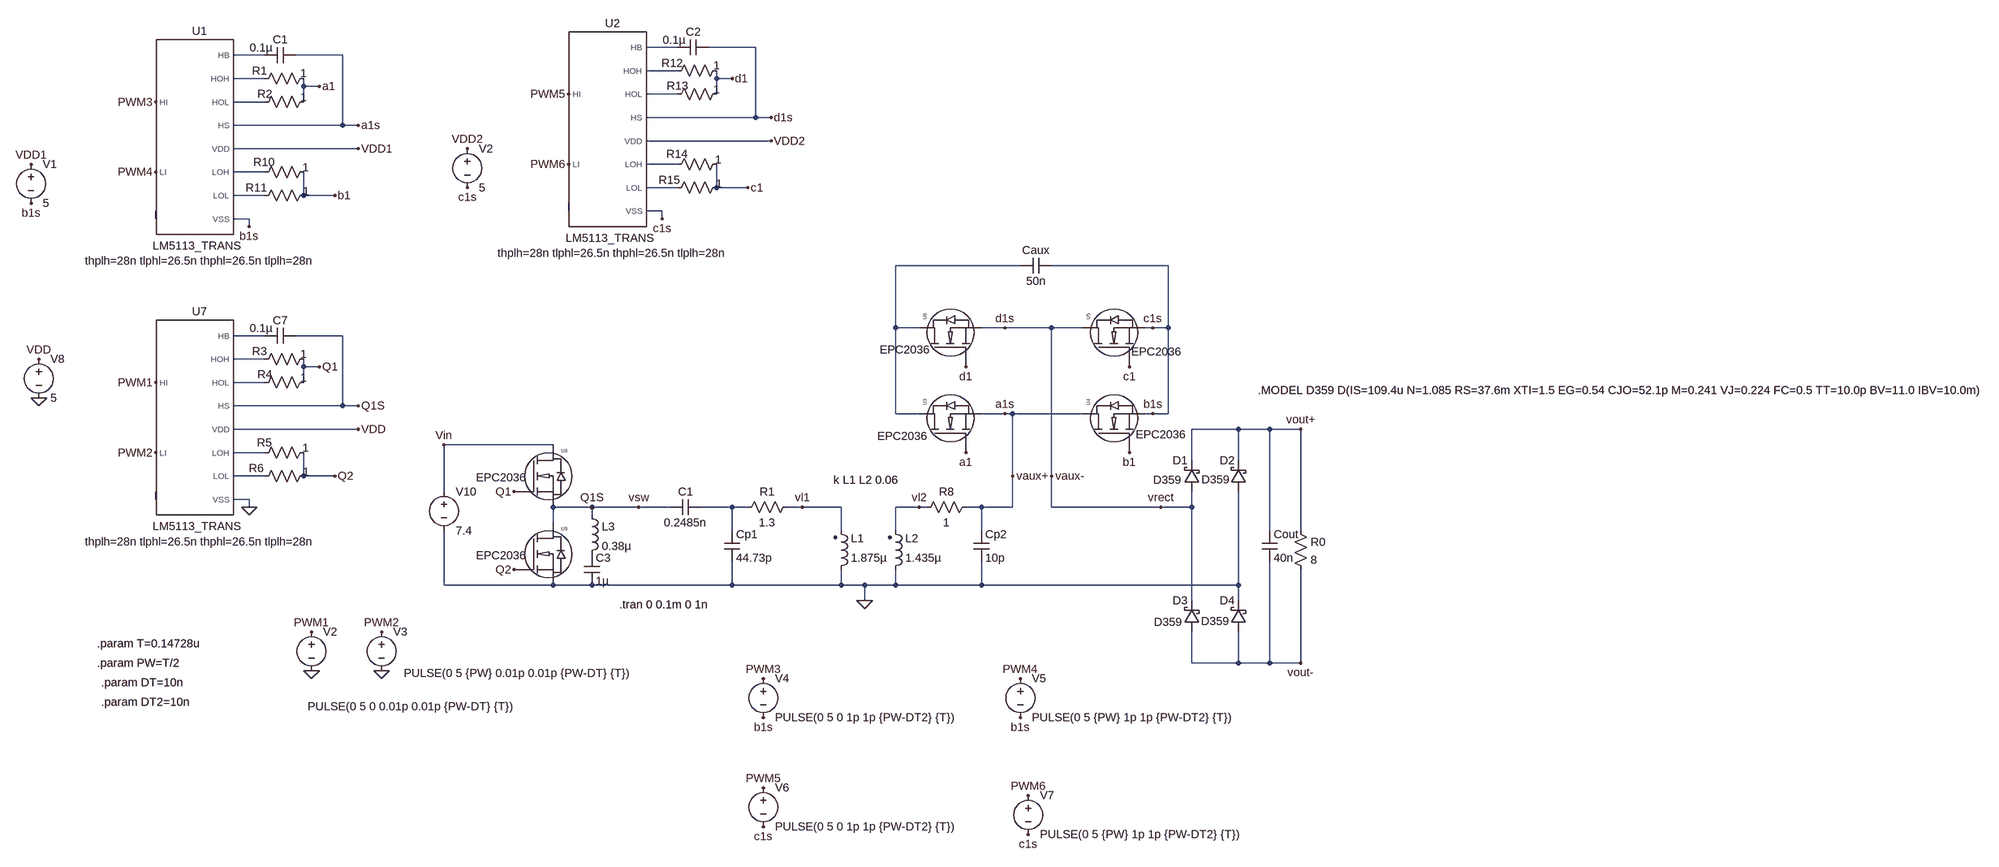
[diagram p0: schematic WPT_Coupled_full_driver.asc]
WPT_Coupled_full_driver.asc, the LTspice schematic file:
Version 4
SHEET 1 3496 796
WIRE 704 -1104 640 -1104
WIRE 864 -1104 768 -1104
WIRE -144 -1088 -208 -1088
WIRE 16 -1088 -80 -1088
WIRE 704 -1056 640 -1056
WIRE -144 -1040 -208 -1040
WIRE 784 -1040 784 -1056
WIRE 816 -1040 784 -1040
WIRE -64 -1024 -64 -1040
WIRE -32 -1024 -64 -1024
WIRE 704 -1008 640 -1008
WIRE 784 -1008 784 -1040
WIRE -144 -992 -208 -992
WIRE -64 -992 -64 -1024
WIRE 864 -960 864 -1104
WIRE 864 -960 640 -960
WIRE 896 -960 864 -960
WIRE 16 -944 16 -1088
WIRE 16 -944 -208 -944
WIRE 48 -944 16 -944
WIRE 896 -912 640 -912
WIRE 48 -896 -208 -896
WIRE 704 -864 640 -864
WIRE -144 -848 -208 -848
WIRE 704 -816 640 -816
WIRE 784 -816 784 -864
WIRE 848 -816 784 -816
WIRE -144 -800 -208 -800
WIRE -64 -800 -64 -848
WIRE 0 -800 -64 -800
WIRE 480 -768 480 -784
WIRE 672 -768 640 -768
WIRE -368 -752 -368 -768
WIRE -176 -752 -208 -752
WIRE 672 -752 672 -768
WIRE -176 -736 -176 -752
WIRE 1408 -656 1152 -656
WIRE 1712 -656 1472 -656
WIRE 1152 -528 1152 -656
WIRE 1200 -528 1152 -528
WIRE 1376 -528 1328 -528
WIRE 1472 -528 1376 -528
WIRE 1536 -528 1472 -528
WIRE 1680 -528 1664 -528
WIRE 1712 -528 1712 -656
WIRE 1712 -528 1680 -528
WIRE -144 -512 -208 -512
WIRE 16 -512 -80 -512
WIRE -144 -464 -208 -464
WIRE -64 -448 -64 -464
WIRE -32 -448 -64 -448
WIRE -144 -416 -208 -416
WIRE -64 -416 -64 -448
WIRE 16 -368 16 -512
WIRE 16 -368 -208 -368
WIRE 48 -368 16 -368
WIRE 1152 -352 1152 -528
WIRE 1200 -352 1152 -352
WIRE 1376 -352 1328 -352
WIRE 1392 -352 1376 -352
WIRE 1536 -352 1392 -352
WIRE 1680 -352 1664 -352
WIRE 1712 -352 1712 -528
WIRE 1712 -352 1680 -352
WIRE 48 -320 -208 -320
WIRE 1856 -320 1760 -320
WIRE 1920 -320 1856 -320
WIRE 1984 -320 1920 -320
WIRE 448 -288 224 -288
WIRE -144 -272 -208 -272
WIRE 1760 -256 1760 -320
WIRE 1856 -256 1856 -320
WIRE -144 -224 -208 -224
WIRE -64 -224 -64 -272
WIRE 0 -224 -64 -224
WIRE 1392 -224 1392 -352
WIRE 1472 -224 1472 -528
WIRE 224 -192 224 -288
WIRE -368 -176 -368 -192
WIRE -176 -176 -208 -176
WIRE -176 -160 -176 -176
WIRE 528 -160 448 -160
WIRE 624 -160 528 -160
WIRE 688 -160 624 -160
WIRE 816 -160 752 -160
WIRE 848 -160 816 -160
WIRE 960 -160 928 -160
WIRE 1040 -160 960 -160
WIRE 1200 -160 1152 -160
WIRE 1216 -160 1200 -160
WIRE 1328 -160 1296 -160
WIRE 1392 -160 1392 -224
WIRE 1392 -160 1328 -160
WIRE 1472 -160 1472 -224
WIRE 1696 -160 1472 -160
WIRE 1760 -160 1760 -192
WIRE 1760 -160 1696 -160
WIRE 528 -144 528 -160
WIRE 448 -128 448 -160
WIRE 816 -112 816 -160
WIRE 1040 -112 1040 -160
WIRE 1152 -112 1152 -160
WIRE 1328 -112 1328 -160
WIRE 1920 -112 1920 -320
WIRE 1984 -112 1984 -320
WIRE 224 0 224 -112
WIRE 448 0 224 0
WIRE 528 0 448 0
WIRE 816 0 816 -48
WIRE 816 0 528 0
WIRE 1040 0 1040 -32
WIRE 1040 0 816 0
WIRE 1088 0 1040 0
WIRE 1152 0 1152 -32
WIRE 1152 0 1088 0
WIRE 1328 0 1328 -48
WIRE 1328 0 1152 0
WIRE 1856 0 1856 -192
WIRE 1856 0 1328 0
WIRE 1088 32 1088 0
WIRE 1760 32 1760 -160
WIRE 1856 32 1856 0
WIRE 1760 160 1760 96
WIRE 1856 160 1856 96
WIRE 1856 160 1760 160
WIRE 1920 160 1920 -48
WIRE 1920 160 1856 160
WIRE 1984 160 1984 -32
WIRE 1984 160 1920 160
FLAG -608 -464 VDD
FLAG -608 -384 0
FLAG -32 -448 Q1
FLAG 0 -224 Q2
FLAG 48 -368 Q1S
FLAG -368 -416 PWM1
FLAG -368 -272 PWM2
FLAG 48 -320 VDD
FLAG -176 -160 0
FLAG 1088 32 0
FLAG 960 -160 vl1
FLAG 1200 -160 vl2
FLAG 368 -192 Q1
FLAG 368 -32 Q2
FLAG 96 176 0
FLAG 528 -160 Q1S
FLAG 1296 -272 a1
FLAG 1632 -448 c1
FLAG 1632 -272 b1
FLAG 1296 -448 d1
FLAG 880 192 PWM3
FLAG 1408 192 PWM4
FLAG 880 272 b1s
FLAG 1408 272 b1s
FLAG 880 416 PWM5
FLAG 1424 432 PWM6
FLAG 880 496 c1s
FLAG 1424 512 c1s
FLAG 1984 -320 vout+
FLAG 1984 160 vout-
FLAG 1392 -224 vaux+
FLAG 1472 -224 vaux-
FLAG 224 -288 Vin
FLAG -48 96 PWM1
FLAG 96 96 PWM2
FLAG 1376 -352 a1s
FLAG 1376 -528 d1s
FLAG 1680 -352 b1s
FLAG 1680 -528 c1s
FLAG 1696 -160 vrect
FLAG 624 -160 vsw
FLAG -48 176 0
FLAG -32 -1024 a1
FLAG 0 -800 b1
FLAG 48 -944 a1s
FLAG -368 -992 PWM3
FLAG -368 -848 PWM4
FLAG 48 -896 VDD1
FLAG -176 -736 b1s
FLAG 816 -1040 d1
FLAG 848 -816 c1
FLAG 896 -960 d1s
FLAG 480 -1008 PWM5
FLAG 480 -864 PWM6
FLAG 896 -912 VDD2
FLAG 672 -752 c1s
FLAG -624 -864 VDD1
FLAG -624 -784 b1s
FLAG 272 -896 VDD2
FLAG 272 -816 c1s
SYMBOL LM5113_TRANS -272 -240 R0
SYMATTR InstName U7
SYMBOL voltage -608 -480 R0
WINDOW 123 0 0 Left 0
WINDOW 39 0 0 Left 0
SYMATTR InstName V8
SYMATTR Value 5
SYMBOL res -48 -480 R90
WINDOW 0 16 107 VBottom 2
WINDOW 3 -10 16 VTop 2
SYMATTR InstName R3
SYMATTR Value 1
SYMBOL res -48 -432 R90
WINDOW 0 15 96 VBottom 2
WINDOW 3 -9 16 VTop 2
SYMATTR InstName R4
SYMATTR Value 1
SYMBOL res -48 -288 R90
WINDOW 0 11 97 VBottom 2
WINDOW 3 -9 12 VTop 2
SYMATTR InstName R5
SYMATTR Value 1
SYMBOL res -48 -240 R90
WINDOW 0 16 113 VBottom 2
WINDOW 3 -8 11 VTop 2
SYMATTR InstName R6
SYMATTR Value 1
SYMBOL cap -80 -528 R90
WINDOW 0 0 32 VBottom 2
WINDOW 3 -15 71 VTop 2
SYMATTR InstName C7
SYMATTR Value 0.1µ
SYMBOL cap 752 -176 R90
WINDOW 0 0 32 VBottom 2
WINDOW 3 32 32 VTop 2
SYMATTR InstName C1
SYMATTR Value 0.2485n
SYMBOL ind2 1024 -16 M180
WINDOW 0 36 80 Left 2
WINDOW 3 36 40 Left 2
SYMATTR InstName L1
SYMATTR Value 1.875µ
SYMATTR Type ind
SYMBOL ind2 1136 -16 M180
WINDOW 0 36 80 Left 2
WINDOW 3 36 40 Left 2
SYMATTR InstName L2
SYMATTR Value 1.435µ
SYMATTR Type ind
SYMBOL res 944 -176 R90
WINDOW 0 0 56 VBottom 2
WINDOW 3 32 56 VTop 2
SYMATTR InstName R1
SYMATTR Value 1.3
SYMBOL res 1312 -176 R90
WINDOW 0 0 56 VBottom 2
WINDOW 3 32 56 VTop 2
SYMATTR InstName R8
SYMATTR Value 1
SYMBOL res 1968 -128 R0
SYMATTR InstName R0
SYMATTR Value 8
SYMBOL voltage -48 80 R0
WINDOW 123 0 0 Left 0
WINDOW 39 0 0 Left 0
WINDOW 3 -8 169 Left 2
SYMATTR Value PULSE(0 5 0 0.01p 0.01p {PW-DT} {T})
SYMATTR InstName V2
SYMBOL EPCGaN 368 -192 R0
WINDOW 3 -78 -29 Left 2
SYMATTR Value EPC2036
SYMATTR InstName U8
SYMBOL EPCGaN 368 -32 R0
WINDOW 3 -78 -29 Left 2
SYMATTR Value EPC2036
SYMATTR InstName U9
SYMBOL voltage 224 -208 R0
WINDOW 123 0 0 Left 0
WINDOW 39 0 0 Left 0
SYMATTR InstName V10
SYMATTR Value 7.4
SYMBOL voltage 96 80 R0
WINDOW 123 0 0 Left 0
WINDOW 39 0 0 Left 0
WINDOW 3 46 101 Left 2
SYMATTR Value PULSE(0 5 {PW} 0.01p 0.01p {PW-DT} {T})
SYMATTR InstName V3
SYMBOL cap 512 -64 R0
SYMATTR InstName C3
SYMATTR Value 1µ
SYMBOL ind 512 -160 R0
SYMATTR InstName L3
SYMATTR Value 0.38µ
SYMBOL cap 1472 -672 R90
WINDOW 0 0 32 VBottom 2
WINDOW 3 32 32 VTop 2
SYMATTR InstName Caux
SYMATTR Value 50n
SYMBOL EPCGaN 1296 -272 R270
WINDOW 3 34 -182 VRight 2
SYMATTR Value EPC2036
SYMATTR InstName U3
SYMBOL EPCGaN 1632 -272 R270
WINDOW 3 37 13 VRight 2
SYMATTR Value EPC2036
SYMATTR InstName U4
SYMBOL EPCGaN 1632 -448 R270
WINDOW 3 31 4 VRight 2
SYMATTR Value EPC2036
SYMATTR InstName U5
SYMBOL EPCGaN 1296 -448 R270
WINDOW 3 35 -177 VRight 2
SYMATTR Value EPC2036
SYMATTR InstName U6
SYMBOL voltage 880 176 R0
WINDOW 123 0 0 Left 0
WINDOW 39 24 124 Left 2
SYMATTR InstName V4
SYMATTR Value PULSE(0 5 0 1p 1p {PW-DT2} {T})
SYMBOL voltage 1408 176 R0
WINDOW 123 0 0 Left 0
WINDOW 39 24 124 Left 2
SYMATTR InstName V5
SYMATTR Value PULSE(0 5 {PW} 1p 1p {PW-DT2} {T})
SYMBOL voltage 880 400 R0
WINDOW 123 0 0 Left 0
WINDOW 39 24 124 Left 2
SYMATTR InstName V6
SYMATTR Value PULSE(0 5 0 1p 1p {PW-DT2} {T})
SYMBOL voltage 1424 416 R0
WINDOW 123 0 0 Left 0
WINDOW 39 24 124 Left 2
SYMATTR InstName V7
SYMATTR Value PULSE(0 5 {PW} 1p 1p {PW-DT2} {T})
SYMBOL cap 1904 -112 R0
SYMATTR InstName Cout
SYMATTR Value 40n
SYMBOL cap 800 -112 R0
SYMATTR InstName Cp1
SYMATTR Value 44.73p
SYMBOL cap 1312 -112 R0
SYMATTR InstName Cp2
SYMATTR Value 10p
SYMBOL schottky 1776 -192 R180
WINDOW 0 24 64 Left 2
WINDOW 3 37 24 Left 2
SYMATTR InstName D1
SYMATTR Value D359
SYMBOL schottky 1872 -192 R180
WINDOW 0 24 64 Left 2
WINDOW 3 34 25 Left 2
SYMATTR InstName D2
SYMATTR Value D359
SYMBOL schottky 1776 96 R180
WINDOW 0 24 64 Left 2
WINDOW 3 36 20 Left 2
SYMATTR InstName D3
SYMATTR Value D359
SYMBOL schottky 1872 96 R180
WINDOW 0 24 64 Left 2
WINDOW 3 35 22 Left 2
SYMATTR InstName D4
SYMATTR Value D359
SYMBOL LM5113_TRANS -272 -816 R0
SYMATTR InstName U1
SYMBOL res -48 -1056 R90
WINDOW 0 16 107 VBottom 2
WINDOW 3 -10 16 VTop 2
SYMATTR InstName R1
SYMATTR Value 1
SYMBOL res -48 -1008 R90
WINDOW 0 15 96 VBottom 2
WINDOW 3 -9 16 VTop 2
SYMATTR InstName R2
SYMATTR Value 1
SYMBOL res -48 -864 R90
WINDOW 0 11 97 VBottom 2
WINDOW 3 -9 12 VTop 2
SYMATTR InstName R10
SYMATTR Value 1
SYMBOL res -48 -816 R90
WINDOW 0 16 113 VBottom 2
WINDOW 3 -8 11 VTop 2
SYMATTR InstName R11
SYMATTR Value 1
SYMBOL cap -80 -1104 R90
WINDOW 0 0 32 VBottom 2
WINDOW 3 -15 71 VTop 2
SYMATTR InstName C1
SYMATTR Value 0.1µ
SYMBOL LM5113_TRANS 576 -832 R0
SYMATTR InstName U2
SYMBOL res 800 -1072 R90
WINDOW 0 16 107 VBottom 2
WINDOW 3 -10 16 VTop 2
SYMATTR InstName R12
SYMATTR Value 1
SYMBOL res 800 -1024 R90
WINDOW 0 15 96 VBottom 2
WINDOW 3 -9 16 VTop 2
SYMATTR InstName R13
SYMATTR Value 1
SYMBOL res 800 -880 R90
WINDOW 0 11 97 VBottom 2
WINDOW 3 -9 12 VTop 2
SYMATTR InstName R14
SYMATTR Value 1
SYMBOL res 800 -832 R90
WINDOW 0 16 113 VBottom 2
WINDOW 3 -8 11 VTop 2
SYMATTR InstName R15
SYMATTR Value 1
SYMBOL cap 768 -1120 R90
WINDOW 0 0 32 VBottom 2
WINDOW 3 -15 71 VTop 2
SYMATTR InstName C2
SYMATTR Value 0.1µ
SYMBOL voltage -624 -880 R0
WINDOW 123 0 0 Left 0
WINDOW 39 0 0 Left 0
SYMATTR InstName V1
SYMATTR Value 5
SYMBOL voltage 272 -912 R0
WINDOW 123 0 0 Left 0
WINDOW 39 0 0 Left 0
SYMATTR InstName V2
SYMATTR Value 5
TEXT 1024 -216 Left 2 !k L1 L2 0.06
TEXT 584 40 Left 2 !.tran 0 0.1m 0 1n
TEXT -488 120 Left 2 !.param T=0.14728u
TEXT -488 160 Left 2 !.param PW=T/2
TEXT -480 200 Left 2 !.param DT=10n
TEXT -480 240 Left 2 !.param DT2=10n
TEXT 1896 -400 Left 2 !.MODEL D359 D(IS=109.4u N=1.085 RS=37.6m XTI=1.5 EG=0.54 CJO=52.1p M=0.241 VJ=0.224 FC=0.5 TT=10.0p BV=11.0 IBV=10.0m)

The netlist it stands for:
* WPT_Coupled_full_driver.asc
XU7 N015 N016 N014 PWM1 vsw PWM2 N017 N018 VDD 0 LM5113_TRANS thplh=28n tlphl=26.5n thphl=26.5n tlplh=28n  ; pins HOH HOL HB HI HS LI LOH LOL VDD VSS
V8 VDD 0 5
R3 Q1 N015 1
R4 Q1 N016 1
R5 Q2 N017 1
R6 Q2 N018 1
C7 vsw N014 0.1µ
C1 N020 vsw 0.2485n
L1 0 vl1 1.875µ
L2 0 vl2 1.435µ
R1 vl1 N020 1.3
R8 a1s vl2 1
R0 vout+ vout- 8
V2 PWM1 0 PULSE(0 5 0 0.01p 0.01p {PW-DT} {T})
XU8 Q1 Vin vsw EPC2036  ; pins gatein drainin N_0
XU9 Q2 vsw 0 EPC2036  ; pins gatein drainin N_0
V10 Vin 0 7.4
V3 PWM2 0 PULSE(0 5 {PW} 0.01p 0.01p {PW-DT} {T})
C3 P001 0 1µ
L3 vsw P001 0.38µ
Caux c1s N013 50n
XU3 a1 N013 a1s EPC2036  ; pins gatein drainin N_0
XU4 b1 a1s c1s EPC2036  ; pins gatein drainin N_0
XU5 c1 vrect c1s EPC2036  ; pins gatein drainin N_0
XU6 d1 N013 vrect EPC2036  ; pins gatein drainin N_0
V4 PWM3 c1s PULSE(0 5 0 1p 1p {PW-DT2} {T})
V5 PWM4 c1s PULSE(0 5 {PW} 1p 1p {PW-DT2} {T})
V6 PWM5 c1s PULSE(0 5 0 1p 1p {PW-DT2} {T})
V7 PWM6 c1s PULSE(0 5 {PW} 1p 1p {PW-DT2} {T})
Cout vout+ vout- 40n
Cp1 N020 0 44.73p
Cp2 a1s 0 10p
D1 vrect vout+ D359
D2 0 vout+ D359
D3 vout- vrect D359
D4 vout- 0 D359
XU1 N004 N006 N002 PWM3 a1s PWM4 N008 N010 VDD1 c1s LM5113_TRANS thplh=28n tlphl=26.5n thphl=26.5n tlplh=28n  ; pins HOH HOL HB HI HS LI LOH LOL VDD VSS
R1 a1 N004 1
R2 a1 N006 1
R10 b1 N008 1
R11 b1 N010 1
C1 a1s N002 0.1µ
XU2 N003 N005 N001 PWM5 vrect PWM6 N007 N009 VDD2 c1s LM5113_TRANS thplh=28n tlphl=26.5n thphl=26.5n tlplh=28n  ; pins HOH HOL HB HI HS LI LOH LOL VDD VSS
R12 d1 N003 1
R13 d1 N005 1
R14 c1 N007 1
R15 c1 N009 1
C2 vrect N001 0.1µ
V1 VDD1 c1s 5
V2 VDD2 c1s 5
.model D D
.lib standard.dio
k L1 L2 0.06
.tran 0 0.1m 0 1n
.param T=0.14728u
.param PW=T/2
.param DT=10n
.param DT2=10n
.MODEL D359 D(IS=109.4u N=1.085 RS=37.6m XTI=1.5 EG=0.54 CJO=52.1p M=0.241 VJ=0.224 FC=0.5 TT=10.0p BV=11.0 IBV=10.0m)
.lib LM5113_TRANS.lib
.lib EPCGanlibrary.lib
.backanno
.end